# Altium schematic sheet DRIVERS.SchDoc
size 386 x 246 mm
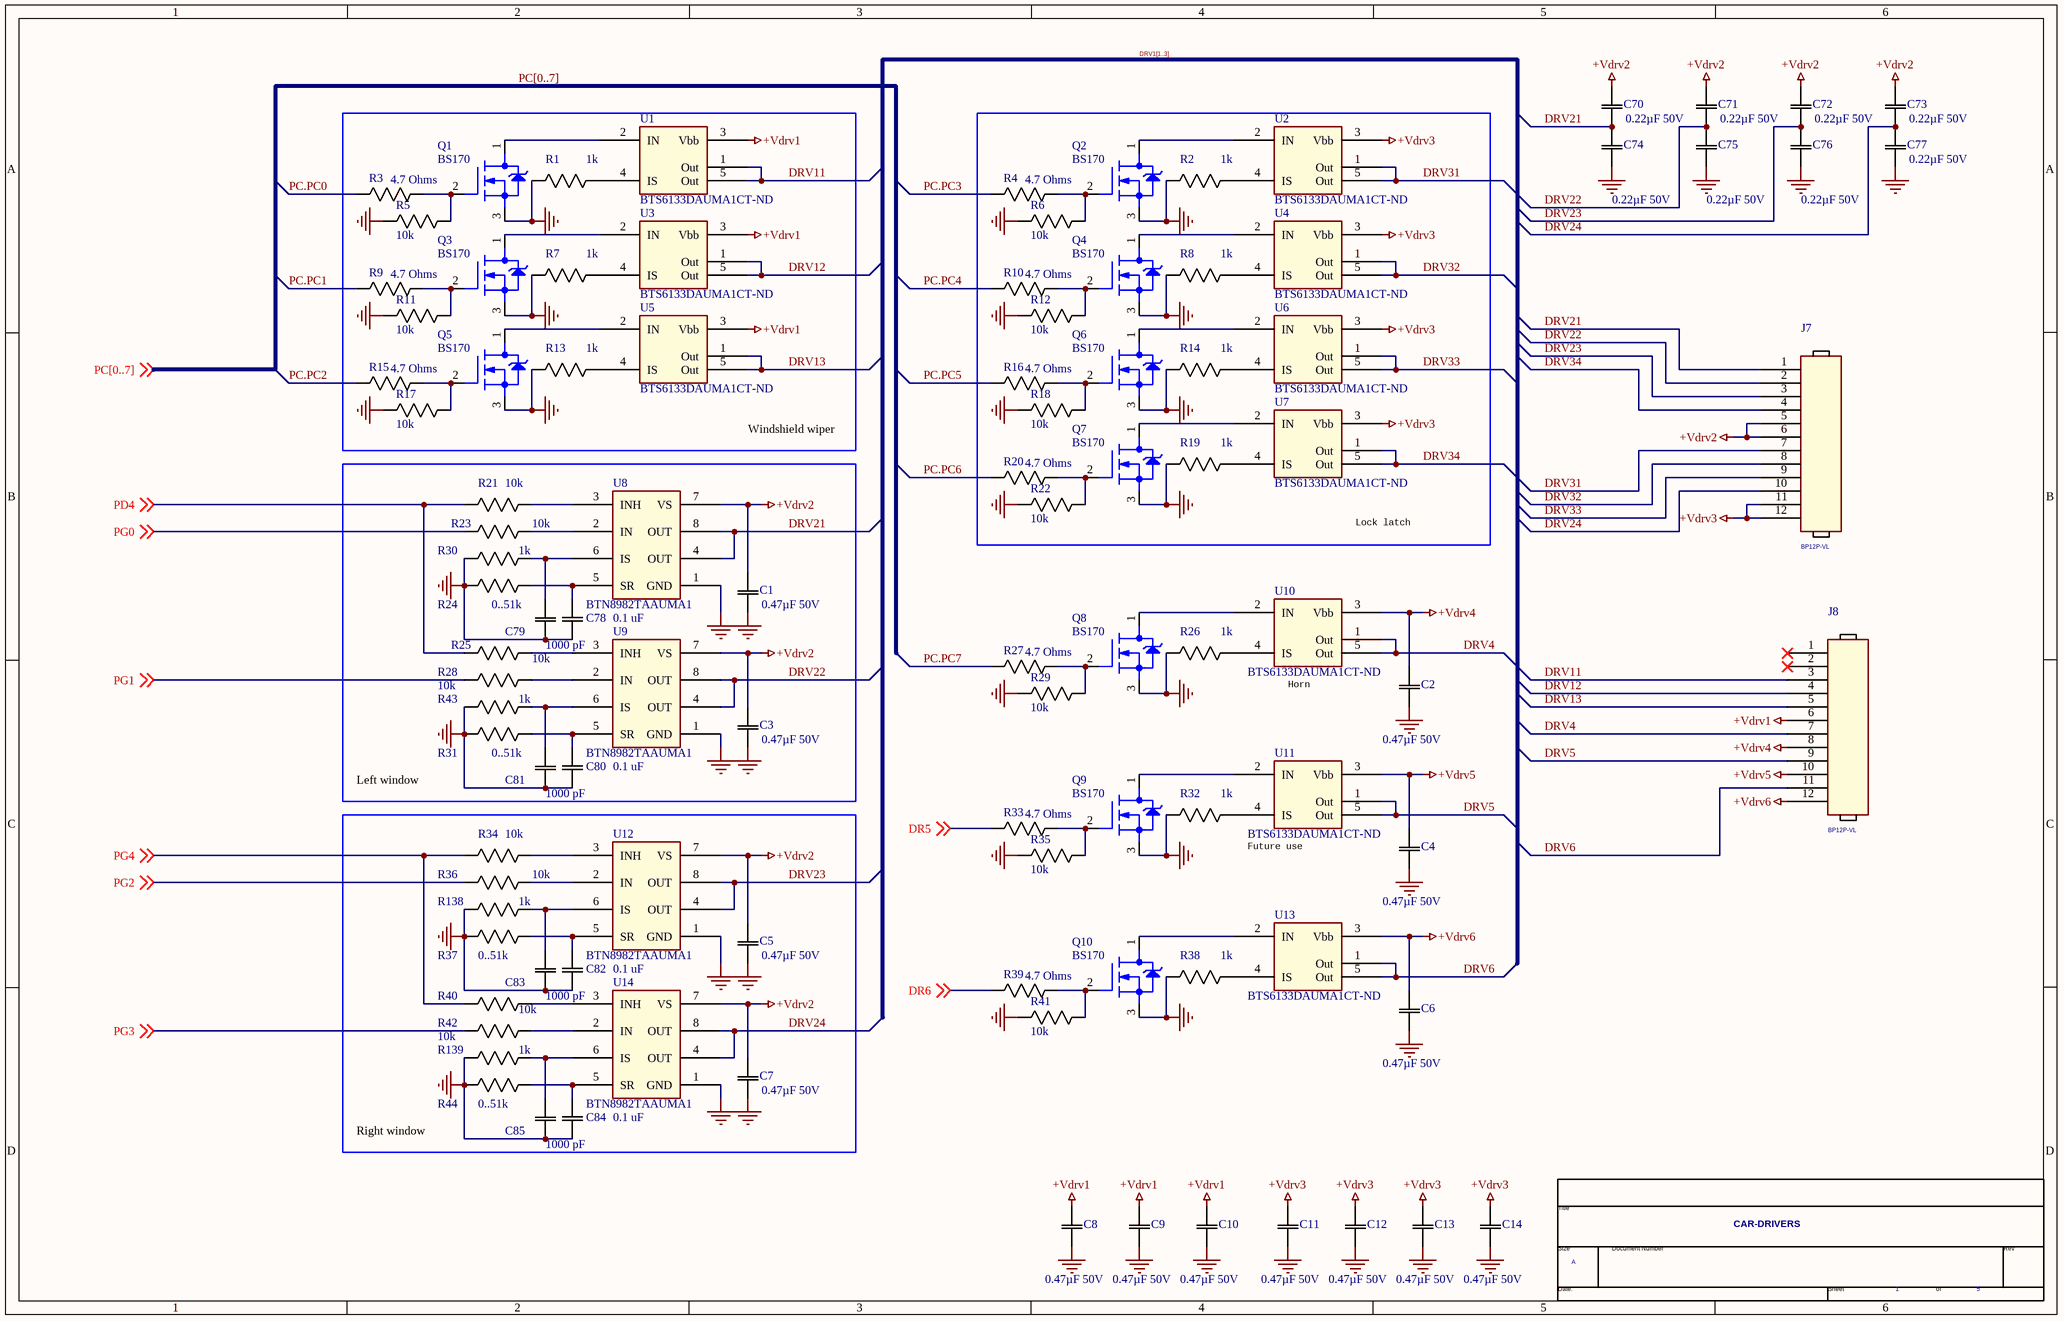
[diagram p0: DRIVERS.SchDoc]

## Parts
*  Page Count: 5  Page Number: 1  Page Size: A  Title: CAR-DRIVERS  (hidden comment: TitleBlock0)  (graphical)
C1  0.47µF 50V  [SR20]
C2  0.47µF 50V  [SR20]
C3  0.47µF 50V  [SR20]
C4  0.47µF 50V  [SR20]
C5  0.47µF 50V  [SR20]
C6  0.47µF 50V  [SR20]
C7  0.47µF 50V  [SR20]
C8  0.47µF 50V  [SR20]
C9  0.47µF 50V  [SR20]
C10  0.47µF 50V  [SR20]
C11  0.47µF 50V  [SR20]
C12  0.47µF 50V  [SR20]
C13  0.47µF 50V  [SR20]
C14  0.47µF 50V  [SR20]
C70  0.22µF 50V  [SR20]
C71  0.22µF 50V  [SR20]
C72  0.22µF 50V  [SR20]
C73  0.22µF 50V  [SR20]
C74  0.22µF 50V  [SR20]
C75  0.22µF 50V  [SR20]
C76  0.22µF 50V  [SR20]
C77  0.22µF 50V  [SR20]
C78  0.1 uF  [SR20]
C79  1000 pF  [SR20]
C80  0.1 uF  [SR20]
C81  1000 pF  [SR20]
C82  0.1 uF  [SR20]
C83  1000 pF  [SR20]
C84  0.1 uF  [SR20]
C85  1000 pF  [SR20]
J7  BP12P-VL  [MOLEX_0874271202]
J8  BP12P-VL  [MOLEX_0874271202]
Q1  BS170  [TO-92]
Q2  BS170  [TO-92]
Q3  BS170  [TO-92]
Q4  BS170  [TO-92]
Q5  BS170  [TO-92]
Q6  BS170  [TO-92]
Q7  BS170  [TO-92]
Q8  BS170  [TO-92]
Q9  BS170  [TO-92]
Q10  BS170  [TO-92]
R1  1k  [RES AXIAL 1/6W]
R2  1k  [RES AXIAL 1/6W]
R3  4.7 Ohms  [RES AXIAL 1/6W]
R4  4.7 Ohms  [RES AXIAL 1/6W]
R5  10k  [RES AXIAL 1/6W]
R6  10k  [RES AXIAL 1/6W]
R7  1k  [RES AXIAL 1/6W]
R8  1k  [RES AXIAL 1/6W]
R9  4.7 Ohms  [RES AXIAL 1/6W]
R10  4.7 Ohms  [RES AXIAL 1/6W]
R11  10k  [RES AXIAL 1/6W]
R12  10k  [RES AXIAL 1/6W]
R13  1k  [RES AXIAL 1/6W]
R14  1k  [RES AXIAL 1/6W]
R15  4.7 Ohms  [RES AXIAL 1/6W]
R16  4.7 Ohms  [RES AXIAL 1/6W]
R17  10k  [RES AXIAL 1/6W]
R18  10k  [RES AXIAL 1/6W]
R19  1k  [RES AXIAL 1/6W]
R20  4.7 Ohms  [RES AXIAL 1/6W]
R21  10k  [RES AXIAL 1/6W]
R22  10k  [RES AXIAL 1/6W]
R23  10k  [RES AXIAL 1/6W]
R24  0..51k  [RES AXIAL 1/6W]
R25  10k  [RES AXIAL 1/6W]
R26  1k  [RES AXIAL 1/6W]
R27  4.7 Ohms  [RES AXIAL 1/6W]
R28  10k  [RES AXIAL 1/6W]
R29  10k  [RES AXIAL 1/6W]
R30  1k  [RES AXIAL 1/6W]
R31  0..51k  [RES AXIAL 1/6W]
R32  1k  [RES AXIAL 1/6W]
R33  4.7 Ohms  [RES AXIAL 1/6W]
R34  10k  [RES AXIAL 1/6W]
R35  10k  [RES AXIAL 1/6W]
R36  10k  [RES AXIAL 1/6W]
R37  0..51k  [RES AXIAL 1/6W]
R38  1k  [RES AXIAL 1/6W]
R39  4.7 Ohms  [RES AXIAL 1/6W]
R40  10k  [RES AXIAL 1/6W]
R41  10k  [RES AXIAL 1/6W]
R42  10k  [RES AXIAL 1/6W]
R43  1k  [RES AXIAL 1/6W]
R44  0..51k  [RES AXIAL 1/6W]
R138  1k  [RES AXIAL 1/6W]
R139  1k  [RES AXIAL 1/6W]
U1  BTS6133DAUMA1CT-ND  [TO114P998X235-6_5N_L]
U2  BTS6133DAUMA1CT-ND  [TO114P998X235-6_5N_L]
U3  BTS6133DAUMA1CT-ND  [TO114P998X235-6_5N_L]
U4  BTS6133DAUMA1CT-ND  [TO114P998X235-6_5N_L]
U5  BTS6133DAUMA1CT-ND  [TO114P998X235-6_5N_L]
U6  BTS6133DAUMA1CT-ND  [TO114P998X235-6_5N_L]
U7  BTS6133DAUMA1CT-ND  [TO114P998X235-6_5N_L]
U8  BTN8982TAAUMA1  [TO263-7]
U9  BTN8982TAAUMA1  [TO263-7]
U10  BTS6133DAUMA1CT-ND  [TO114P998X235-6_5N_L]
U11  BTS6133DAUMA1CT-ND  [TO114P998X235-6_5N_L]
U12  BTN8982TAAUMA1  [TO263-7]
U13  BTS6133DAUMA1CT-ND  [TO114P998X235-6_5N_L]
U14  BTN8982TAAUMA1  [TO263-7]

## Blocks framed on the sheet
Windshield wiper: Q1 Q3 Q5 R1 R3 R5 R7 R9 R11 R13 R15 R17 U1 U3 U5
Lock latch: Q2 Q4 Q6 Q7 R2 R4 R6 R8 R10 R12 R14 R16 R18-R20 R22 U2 U4 U6 U7
Left window: C1 C3 C78-C81 R21 R23-R25 R28 R30 R31 R43 U8 U9
Right window: C5 C7 C82-C85 R34 R36 R37 R40 R42 R44 R138 R139 U12 U14

## Nets
+Vdrv1: C8.2 C9.2 C10.2 J8.6 U1.3(Vbb) U3.3(Vbb) U5.3(Vbb)
+Vdrv2: C1.2 C3.2 C5.2 C7.2 C70.2 C71.2 C72.2 C73.2 J7.5 J7.6 U8.7(VS) U9.7(VS) U12.7(VS) U14.7(VS)
+Vdrv3: C11.2 C12.2 C13.2 C14.2 J7.11 J7.12 U2.3(Vbb) U4.3(Vbb) U6.3(Vbb) U7.3(Vbb)
+Vdrv4: C2.2 J8.8 U10.3(Vbb)
+Vdrv5: C4.2 J8.10 U11.3(Vbb)
+Vdrv6: C6.2 J8.12 U13.3(Vbb)
GND: C1.1 C2.1 C3.1 C4.1 C5.1 C6.1 C7.1 C8.1 C9.1 C10.1 C11.1 C12.1 C13.1 C14.1 C74.1 C75.1 C76.1 C77.1 C78.2 C79.1 C80.2 C81.1 C82.2 C83.1 C84.2 C85.1 Q1.3(S) Q2.3(S) Q3.3(S) Q4.3(S) Q5.3(S) Q6.3(S) Q7.3(S) Q8.3(S) Q9.3(S) Q10.3(S) R1.2 R2.2 R5.1 R6.1 R7.2 R8.2 R11.1 R12.1 R13.2 R14.2 R17.1 R18.1 R19.2 R22.1 R24.1 R26.2 R29.1 R30.2 R31.1 R32.2 R35.1 R37.1 R38.2 R41.1 R43.2 R44.1 R138.2 R139.2 U8.1(GND) U9.1(GND) U12.1(GND) U14.1(GND)
DR5: R33.2 ; off-sheet DR5
DR6: R39.2 ; off-sheet DR6
DRV4: J8.7 U10.1(Out) U10.5(Out)
DRV5: J8.9 U11.1(Out) U11.5(Out)
DRV6: J8.11 U13.1(Out) U13.5(Out)
DRV11: J8.3 U1.1(Out) U1.5(Out)
DRV12: J8.4 U3.1(Out) U3.5(Out)
DRV13: J8.5 U5.1(Out) U5.5(Out)
DRV21: C70.1 C74.2 J7.1 U8.4(OUT) U8.8(OUT)
DRV22: C71.1 C75.2 J7.2 U9.4(OUT) U9.8(OUT)
DRV23: C72.1 C76.2 J7.3 U12.4(OUT) U12.8(OUT)
DRV24: C73.1 C77.2 J7.10 U14.4(OUT) U14.8(OUT)
DRV31: J7.7 U2.1(Out) U2.5(Out)
DRV32: J7.8 U4.1(Out) U4.5(Out)
DRV33: J7.9 U6.1(Out) U6.5(Out)
DRV34: J7.4 U7.1(Out) U7.5(Out)
PC.PC0: R3.2
PC.PC1: R9.2
PC.PC2: R15.2
PC.PC3: R4.2
PC.PC4: R10.2
PC.PC5: R16.2
PC.PC6: R20.2
PC.PC7: R27.2
PD4: R21.1 R25.1 ; off-sheet PD4
PG0: R23.1 ; off-sheet PG0
PG1: R28.1 ; off-sheet PG1
PG2: R36.1 ; off-sheet PG2
PG3: R42.1 ; off-sheet PG3
PG4: R34.1 R40.1 ; off-sheet PG4
NetC78_1: C78.1 R24.2 U8.5(SR)
NetC79_2: C79.2 R30.1 U8.6(IS)
NetC80_1: C80.1 R31.2 U9.5(SR)
NetC81_2: C81.2 R43.1 U9.6(IS)
NetC82_1: C82.1 R37.2 U12.5(SR)
NetC83_2: C83.2 R138.1 U12.6(IS)
NetC84_1: C84.1 R44.2 U14.5(SR)
NetC85_2: C85.2 R139.1 U14.6(IS)
NetQ1_1: Q1.1(D) U1.2(IN)
NetQ1_2: Q1.2(G) R3.1 R5.2
NetQ2_1: Q2.1(D) U2.2(IN)
NetQ2_2: Q2.2(G) R4.1 R6.2
NetQ3_1: Q3.1(D) U3.2(IN)
NetQ3_2: Q3.2(G) R9.1 R11.2
NetQ4_1: Q4.1(D) U4.2(IN)
NetQ4_2: Q4.2(G) R10.1 R12.2
NetQ5_1: Q5.1(D) U5.2(IN)
NetQ5_2: Q5.2(G) R15.1 R17.2
NetQ6_1: Q6.1(D) U6.2(IN)
NetQ6_2: Q6.2(G) R16.1 R18.2
NetQ7_1: Q7.1(D) U7.2(IN)
NetQ7_2: Q7.2(G) R20.1 R22.2
NetQ8_1: Q8.1(D) U10.2(IN)
NetQ8_2: Q8.2(G) R27.1 R29.2
NetQ9_1: Q9.1(D) U11.2(IN)
NetQ9_2: Q9.2(G) R33.1 R35.2
NetQ10_1: Q10.1(D) U13.2(IN)
NetQ10_2: Q10.2(G) R39.1 R41.2
NetR1_1: R1.1 U1.4(IS)
NetR2_1: R2.1 U2.4(IS)
NetR7_1: R7.1 U3.4(IS)
NetR8_1: R8.1 U4.4(IS)
NetR13_1: R13.1 U5.4(IS)
NetR14_1: R14.1 U6.4(IS)
NetR19_1: R19.1 U7.4(IS)
NetR21_2: R21.2 U8.3(INH)
NetR23_2: R23.2 U8.2(IN)
NetR25_2: R25.2 U9.3(INH)
NetR26_1: R26.1 U10.4(IS)
NetR28_2: R28.2 U9.2(IN)
NetR32_1: R32.1 U11.4(IS)
NetR34_2: R34.2 U12.3(INH)
NetR36_2: R36.2 U12.2(IN)
NetR38_1: R38.1 U13.4(IS)
NetR40_2: R40.2 U14.3(INH)
NetR42_2: R42.2 U14.2(IN)

Not connected (* = marked no-connect by the designer): J8 1* 2*

## Buses and harness runs
bus DRV1[1..3]
bus PC[0..7]

## Notes on the sheet
- (near U10) Horn
- Future use
- (in symbol TitleBlock0) Title; Size; Document Number; Rev; Date:; Sheet; of

## Library data of the parts
C1-C14 = CAP RADIAL 2.54: CAP CER 0.47UF 50V X7R RADIAL; Manufacturer_Part_Number: C315C474K5R5TA7303; Vendor: KEMET; Type: DEV; RefDes: RefDes; Value: 0.47µF 50V
C70-C77 = CAP RADIAL 2.54: CAP CER 0.22UF 50V X7R RADIAL; Manufacturer_Part_Number: C320C224K5R5TA; Vendor: KEMET; Type: DEV; RefDes: RefDes; Value: 0.22µF 50V
C78 C80 C82 C84 = CAP RADIAL 2.54: 0.1µF ±10% 100V Ceramic Capacitor X7R Radial; Manufacturer_Part_Number: C320C104K1R5TA7301; Vendor: KEMET; Type: DEV; RefDes: RefDes; Value: 0.1 uF
C79 C81 C83 C85 = CAP RADIAL 2.54: CAP CER 1000PF 50V X7R RADIAL; Manufacturer_Part_Number: C315C102K5R5TA7301; Vendor: KEMET; Type: DEV; RefDes: RefDes; Value: 1000 pF
J7 J8 = HEADER 12
Q1-Q10 = BS170: MOSFET N-CH 60V 500MA TO-92; Manufacturer_Part_Number: ON Semiconductor; Value: BS170
R1 R2 R7 R8 R13 R14 R19 R26 R30 R32 R38 R43 R138 R139 = Resistor Axial  1/6W: RES 1K OHM 1/6W 5% AXIAL; Manufacturer_Part_Number: CFR-12JB-52-1K; Vendor: Yageo; RefDes: RefDes; Type: DEV; Value: 1k
R3 R4 R9 R10 R15 R16 R20 R27 R33 R39 = Resistor Axial  1/6W: RES 4.7 OHM 1/6W 5% AXIAL; Manufacturer_Part_Number: CFR-12JB-52-4R7; Vendor: Yageo; RefDes: RefDes; Type: DEV; Value: 4.7 Ohms
R5 R6 R11 R12 R17 R18 R21-R23 R25 R28 R29 R34-R36 R40-R42 = Resistor Axial  1/6W: RES 10K OHM 1/6W 5% AXIAL; Manufacturer_Part_Number: CFR-12JB-52-10K; Vendor: Yageo; RefDes: RefDes; Type: DEV; Value: 10k
R24 R31 R37 R44 = Resistor Axial  1/6W: RES 1/6W AXIAL; Vendor: Yageo; RefDes: RefDes; Type: DEV; Value: 0..51k
  R31 R44: Manufacturer_Part_Number: *
U8 U9 U12 U14 = BTN7971B
* = TitleBlock0: Page Create Date: March  8, 1995